# Altium schematic sheet ST-Link V2 Dongle.SchDoc
size A4; Organization: TESLA Motors, INC; Address1: 3500 Deer Creek Road; Address2: Palo Alto, CA; Address4: U.S.A.; SheetNumber: 1; SheetTotal: 1
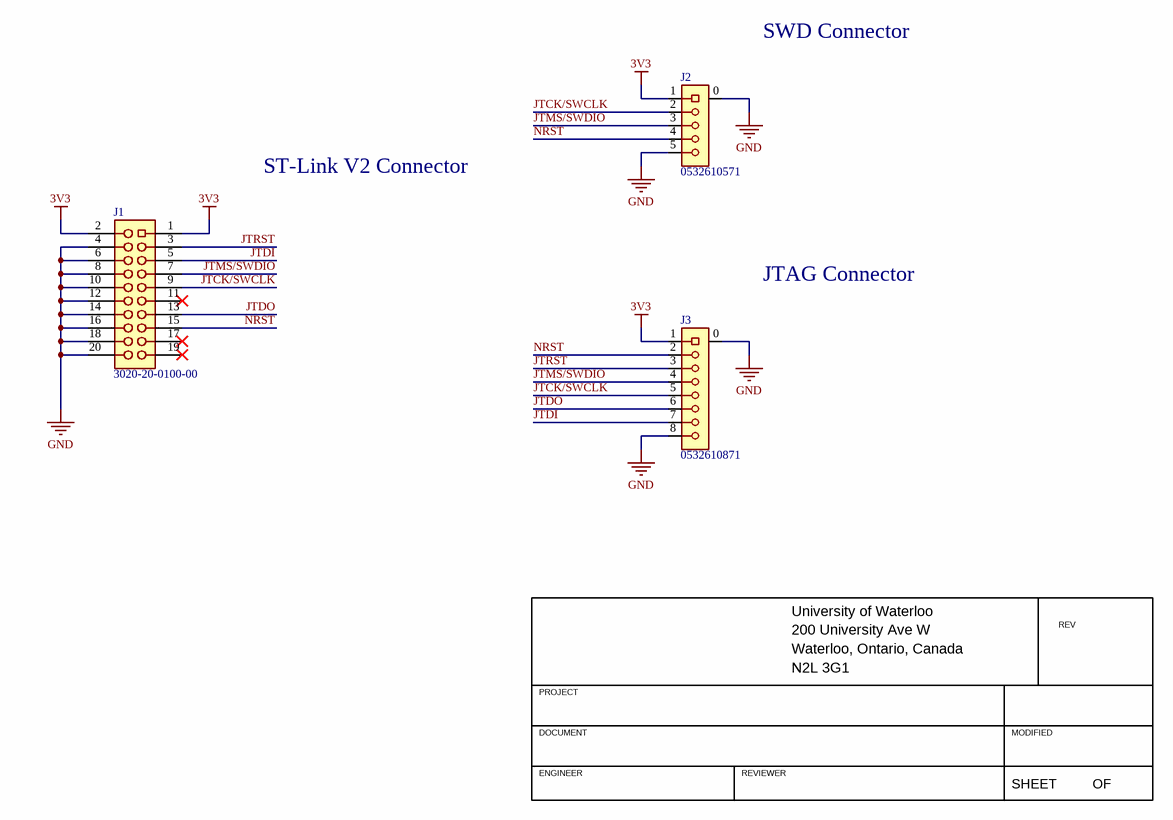
[diagram p0: ST-Link V2 Dongle.SchDoc]

## Parts
J1  3020-20-0100-00  [CNC_3020-20-0100-00]
J2  Manufacturer Part Number 1: 0532610571  [MOLEX-532610571]  (hidden comment: CON_MOLEX-PICO_5POS_RA)
J3  Manufacturer Part Number 1: 0532610871  [MOLEX-532610871]  (hidden comment: CON_MOLEX-PICO_8POS_RA)

## Nets
3V3: J1.1 J1.2 J2.1 J3.1
GND: J1.4 J1.6 J1.8 J1.10 J1.12 J1.14 J1.16 J1.18 J1.20 J2.0 J2.5 J3.0 J3.8
JTCK/SWCLK: J1.9 J2.2 J3.5
JTDI: J1.5 J3.7
JTDO: J1.13 J3.6
JTMS/SWDIO: J1.7 J2.3 J3.4
JTRST: J1.3 J3.3
NRST: J1.15 J2.4 J3.2

Not connected (* = marked no-connect by the designer): J1 11* 17* 19*

## Notes on the sheet
- SWD Connector
- ST-Link V2 Connector
- JTAG Connector
- University of Waterloo
- 200 University Ave W
- REV
- PROJECT
- Waterloo, Ontario, Canada
- N2L 3G1
- DOCUMENT
- ENGINEER
- REVIEWER
- MODIFIED
- SHEET
- OF

## Library data of the parts
J1 = CON_10x2_HEADER: CONN HEADER VERT 20POS 2.54MM; Manufacturer 1: CNC Tech; Manufacturer Part Number 1: 3020-20-0100-00; Supplier 1: Digi-Key; Supplier Part Number 1: 1175-1612-ND
J2 = CON_MOLEX-PICO_5POS_RA: CONN HEADER SMD R/A 5POS 1.25MM; Manufacturer 1: Molex; Supplier 1: Digi-Key; Supplier Part Number 1: WM7623CT-ND
J3 = CON_MOLEX-PICO_8POS_RA: CONN HEADER SMD R/A 8POS 1.25MM; Manufacturer 1: Molex; Supplier 1: Digi-Key; Supplier Part Number 1: WM7626CT-ND